# Altium schematic sheet UART LORA.SchDoc
size A; SheetNumber: 7; SheetTotal: 7
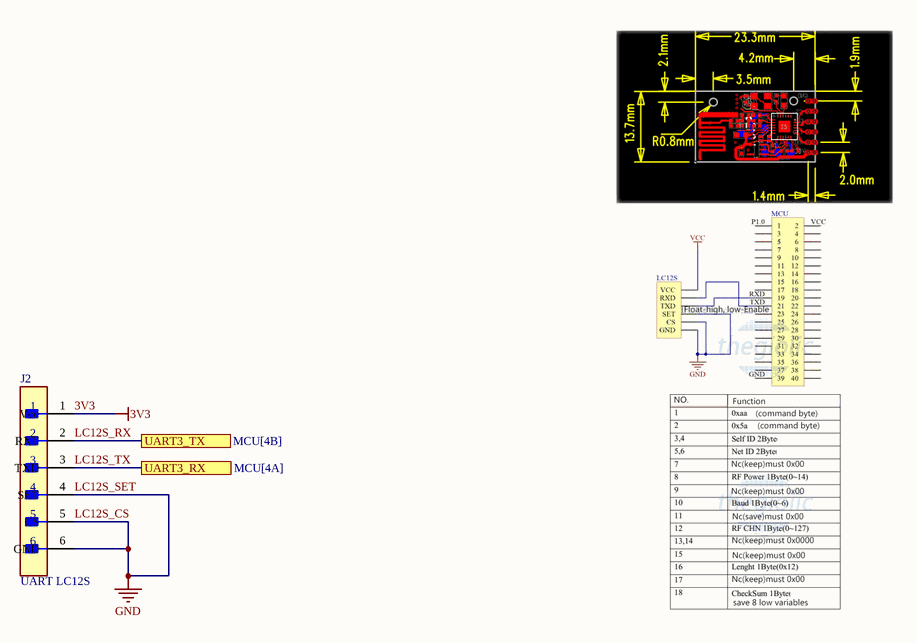
[diagram p0: UART LORA.SchDoc]

## Parts
J2  UART LC12S  [FP-22-28-4060-MFG]

## Ports
UART3_RX (see MCU[4A]), UART3_TX (see MCU[4B])

## Nets
3V3: J2.1(Vcc)
LC12S_CS: J2.4(SET) J2.5(CS) J2.6(GND)  [also labelled GND, LC12S_SET]
LC12S_RX: J2.2(RXT) ; port UART3_TX
LC12S_TX: J2.3(TXD) ; port UART3_RX

## Library data of the parts
J2 = CMP-002-00071-1: KK 254 Breakaway Header, Vertical, 6 Circuits, Tin (Sn) Plating, Mating Pin Length 6.09mm; Voltage Rating: 250V; Gender: Male; Min Operating Temperature: 0°C; Mounting Technology: Through Hole; Max Operating Temperature: 75°C; RoHS Compliant: Yes